# Altium project pi-dock.PrjPcb
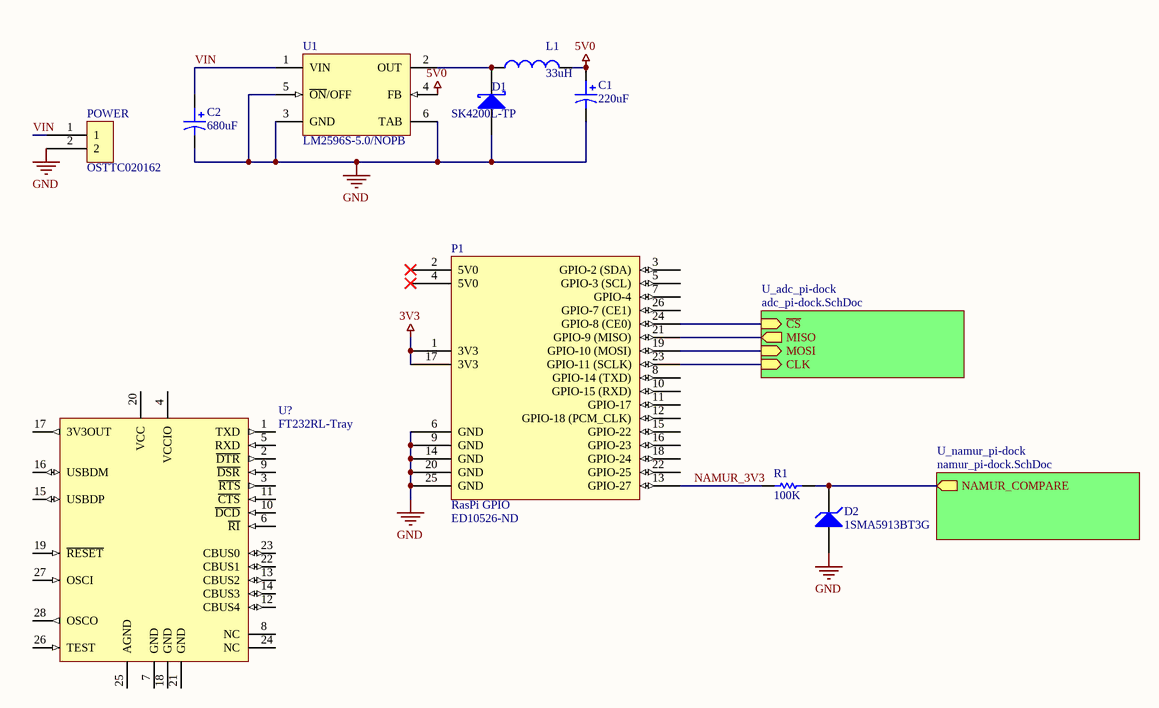
[diagram p0: top_pi-dock.SchDoc]
3 sheets, 46 parts. Net scope: hierarchical (ports join the sheet entries above them; power ports are global).
Board file: pi-dock.PcbDoc
Sheets:
  top_pi-dock.SchDoc
    U_namur_pi-dock = namur_pi-dock.SchDoc
    U_adc_pi-dock = adc_pi-dock.SchDoc

## Sheet top_pi-dock.SchDoc
size Letter

### Parts
C1  220uF  [CAPMP7343X31N]
C2  680uF  [Panasonic FM Series, Type A]
D1  SK4200L-TP  [DIOM6959X26N [DO-214AB]]
D2  1SMA5913BT3G  [DIOM6959X26N [DO-214AB]]
L1  33uH  [CDRH127]
P1  RasPi GPIO  Supplier Part Number 1: ED10526-ND  [HDR2X13]
POWER  OSTTC020162  [DIP2_5MM_SCREWTERM]
R1  100K  [RES_8085]
U1  LM2596S-5.0/NOPB  [TS5B_L]
U?  FT232RL-Tray  [SSOP-28_L]

### Sub-sheets
U_adc_pi-dock = adc_pi-dock.SchDoc: ~{CS} (in), MOSI (in), CLK (in), MISO (out)
U_namur_pi-dock = namur_pi-dock.SchDoc: NAMUR_COMPARE (out)

### Nets
3V3: P1.1(3V3) P1.17(3V3)
5V0: C1.1 L1.2 U1.4(FB)
GND: C1.2 C2.2 D1.2(A) D2.2(A) P1.6(GND) P1.9(GND) P1.14(GND) P1.20(GND) P1.25(GND) POWER.2 U1.3(GND) U1.5(~{ON}/OFF) U1.6(TAB)
NAMUR_3V3: P1.13(GPIO-27) R1.2
VIN: C2.1 POWER.1 U1.1(VIN)
NetD1_1: D1.1(K) L1.1 U1.2(OUT)
NetD2_1: D2.1(K) R1.1 ; sheet U_namur_pi-dock/NAMUR_COMPARE
NetP1_19: P1.19(GPIO-10_(MOSI)) ; sheet U_adc_pi-dock/MOSI
NetP1_21: P1.21(GPIO-9_(MISO)) ; sheet U_adc_pi-dock/MISO
NetP1_23: P1.23(GPIO-11_(SCLK)) ; sheet U_adc_pi-dock/CLK
NetP1_24: P1.24(GPIO-8_(CE0)) ; sheet U_adc_pi-dock/~{CS}

Not connected (* = marked no-connect by the designer): P1 2(5V0)* 3(GPIO-2_(SDA)) 4(5V0)* 5(GPIO-3_(SCL)) 7(GPIO-4) 8(GPIO-14_(TXD)) 10(GPIO-15_(RXD)) 11(GPIO-17) 12(GPIO-18_(PCM_CLK)) 15(GPIO-22) 16(GPIO-23) 18(GPIO-24) 22(GPIO-25) 26(GPIO-7_(CE1)); U? 1(TXD) 2(~{DTR}) 3(~{RTS}) 4(VCCIO) 5(RXD) 6(~{RI}) 7(GND) 8(NC) 9(~{DSR}) 10(~{DCD}) 11(~{CTS}) 12(CBUS4) 13(CBUS2) 14(CBUS3) 15(USBDP) 16(USBDM) 17(3V3OUT) 18(GND) 19(~{RESET}) 20(VCC) 21(GND) 22(CBUS1) 23(CBUS0) 24(NC) 25(AGND) 26(TEST) 27(OSCI) 28(OSCO)

### Library data of the parts
C1 = T491D227K010AT: Kemet CAP TANT 220UF 10V 10% 2917; Value: 220uF; Supplier 1: Digi-Key; Supplier Part Number 1: 399-8379-1-ND; ComponentLink1Description: Datasheet; ComponentLink1URL: http://www.kemet.com/Lists/ProductCatalog/Attachments/254/KEM_T2005_T491.pdf
C2 = EEU-FM1E681: Panasonic CAP ALUM 680UF 25V 20% RADIAL; Value: 680uF; ComponentLink1Description: Datasheet; ComponentLink1URL: http://industrial.panasonic.com/www-data/pdf/ABA0000/ABA0000CE108.pdf; Supplier 1: Digi-Key; Supplier Part Number 1: P12390-ND
D1 = SK4200L-TP: MCC DIODE SCHOTTKY 200V 4A DO214AB; ComponentLink1Description: Datasheet; ComponentLink1URL: http://www.mccsemi.com/up_pdf/SK4200L(SMC).pdf; Supplier 1: Digi-Key; Supplier Part Number 1: SK4200L-TPMSCT-ND
D2 = 1SMA5913BT3G: DIODE ZENER 3.3V 1.5W SMA; ComponentLink1Description: Datasheet; ComponentLink1URL: http://www.onsemi.com/pub_link/Collateral/1SMA5913BT3-D.PDF; Supplier 1: Digi-Key; Supplier Part Number 1: 1SMA5913BT3GOSCT-ND
L1 = CDRH127NP-330MC: Sumida Fixed Inductors 33uH 3A; Value: 33uH; ComponentLink1Description: Datasheet; ComponentLink1URL: http://www.sumida.com/products/pdf/CDRH127,127LD.pdf
P1 = RasPi Header: Raspberry Pi GPIO Header, 13-Pin, Dual row; ComponentLink1Description: Raspberry Pi GPIO Pinout; ComponentLink1URL: http://www.hobbytronics.co.uk/image/data/tutorial/raspberry-pi/gpio-pinout-rev2.jpg; Supplier 1: Digi-Key
POWER = OSTTC020162: ON SHORE TERMINAL BLOCK 5MM VERT 2POS PCB; ComponentLink1URL: http://www.on-shore.com/sites/default/files/manuals/osttcxx0162.pdf; ComponentLink1Description: Datasheet; Supplier 1: Digi-Key; Supplier Part Number 1: ED2600-ND
R1 = CHIP-RES: SMD Chip Resistor; Value: 100K
U1 = CMP-0069-00269-2: SIMPLE SWITCHER® Power Converter 150 KHz 3A Step-Down Voltage Regulator, 5-pin TO-263, Pb-Free; Manufacturer: National Semiconductor; PackageTopMarking: NSUZXYTTE#*LM2596S*-5.0 P+; PowerWise: N; PinCount: 5; ComponentLink3Description: TS5B Package Page; ComponentLink1Description: LM2596 Datasheet; DatasheetVersion: May-2002; ComponentLink3URL: http://www.national.com/packaging/folders/ts5b.html; PackageReference: TS5B; RoHS: Y; ComponentLink2Description: LM2596 Web Page; ComponentLink2URL: http://www.national.com/pf/LM/LM2596.html; ComponentLink1URL: http://www.national.com/ds/LM/LM2596.pdf; CompType: Switcher; RevisionNote: Component URLs added; PackageVersion: revD, Apr-2005; Code_JEDEC: MO-169-AB; PackageDescription: TO-263, Molded, .400 x .390 x .180in, 5 Lead, .067in Pitch, Surface Mount
U? = CMP-0078-00027-1: USB UART Asynchronous Serial Data Transfer Chip, SSOP-28, Tray; DatasheetVersion: ver 2.07, Jul-2010; PackageVersion: 2010; PackageReference: SSOP-28; PackageDescription: 28-Pin Small Outline Package 0.65 mm Pitch

## Sheet namur_pi-dock.SchDoc
size Letter
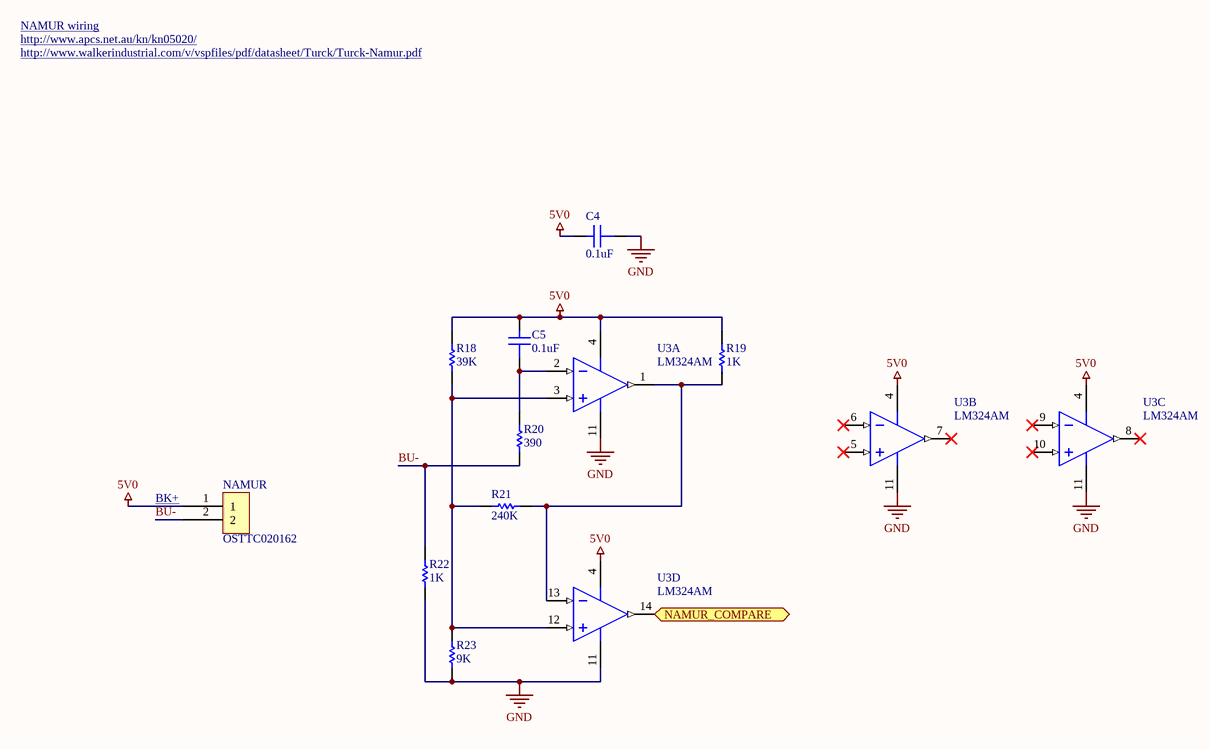
[diagram p1: namur_pi-dock.SchDoc]

### Parts
C4  0.1uF  [CAP_8085]
C5  0.1uF  [CAP_8085]
NAMUR  OSTTC020162  [DIP2_5MM_SCREWTERM]
R18  39K  [RES_8085]
R19  1K  [RES_8085]
R20  390  [RES_8085]
R21  240K  [RES_8085]
R22  1K  [RES_8085]
R23  9K  [RES_8085]
U3  LM324AM  [M14A_N]  (parts A,B,C,D of 4)

### Ports
NAMUR_COMPARE (out)

### Nets
5V0: C4.2 C5.2 NAMUR.1 R18.2 R19.2 U3.4(V+)
GND: C4.1 R22.2 R23.1 U3.11(GND)
BU-: NAMUR.2 R20.2 R22.1
NetC5_1: C5.1 R20.1 U3.2(IN1-)
NetD2_1: U3.14(OUT4) ; port NAMUR_COMPARE
NetR18_1: R18.1 R21.1 R23.2 U3.3(IN1+) U3.12(IN4+)
NetR19_1: R19.1 R21.2 U3.1(OUT1) U3.13(IN4-)

Not connected (* = marked no-connect by the designer): U3 5(IN2+)* 6(IN2-)* 7(OUT2)* 8(OUT3)* 9(IN3-)* 10(IN3+)*

### Notes on the sheet
- NAMUR wiring
- http://www.apcs.net.au/kn/kn05020/
- http://www.walkerindustrial.com/v/vspfiles/pdf/datasheet/Turck/Turck-Namur.pdf
- (near NAMUR) BK+

### Library data of the parts
C4 C5 = CHIP-CAP: SMD Chip Capacitor; Value: 0.1uF
NAMUR = OSTTC020162: as POWER on sheet top_pi-dock; ComponentLink1URL: http://www.on-shore.com/sites/default/files/manuals/osttcxx0162.pdf; ComponentLink1Description: Datasheet; Supplier 1: Digi-Key; Supplier Part Number 1: ED2600-ND
R18-R23 = CHIP-RES: SMD Chip Resistor
  R18: Value: 39K
  R19 R22: Value: 1K
  R20: Value: 390
  R21: Value: 240K
  R23: Value: 9K
U3 = LM324AM: Low Power Quad Operational Amplifier, 14-pin Narrow SOIC; Manufacturer: National Semiconductor; PackageTopMarking: NSUZXYTTE#*LM324AM; PowerWise: N; CompType: Amplifiers; Published: 4-Dec-2008; LatestRevisionDate: 13-Jan-2009; LatestRevisionNote: Sim Model Added.; DatasheetVersion: Aug-2000; PackageVersion: revJ, Jan-1996; PackageReference: M14A; Publisher: Altium Limited; PackageDescription: Molded Package S.O., .150in Wide, 14 Lead; Supplier 1: Farnell; Supplier Part Number 1: 9486909; PartNumber: LM324AM; RoHS: N; PinCount: 14; Code_JEDEC: MS-012AB; Code_IPC: SOIC127P600-14; ComponentLink1Description: LM324 Datasheet; ComponentLink1URL: http://www.national.com/ds/LM/LM324.pdf; ComponentLink2Description: LM324 Web Page; ComponentLink2URL: http://www.national.com/pf/LM/LM324.html; ComponentLink3Description: M14A Package Page; ComponentLink3URL: http://www.national.com/packaging/folders/m14a.html

## Sheet adc_pi-dock.SchDoc
size Letter
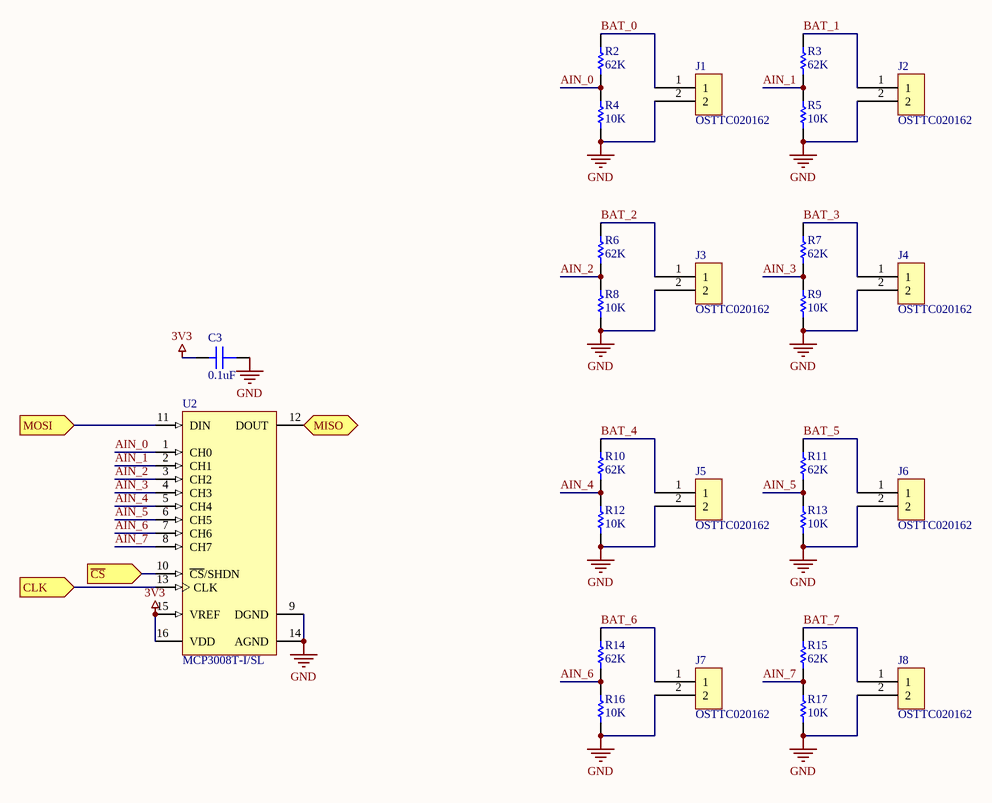
[diagram p2: adc_pi-dock.SchDoc]

### Parts
C3  0.1uF  [CAP_8085]
J1  OSTTC020162  [DIP2_5MM_SCREWTERM]
J2  OSTTC020162  [DIP2_5MM_SCREWTERM]
J3  OSTTC020162  [DIP2_5MM_SCREWTERM]
J4  OSTTC020162  [DIP2_5MM_SCREWTERM]
J5  OSTTC020162  [DIP2_5MM_SCREWTERM]
J6  OSTTC020162  [DIP2_5MM_SCREWTERM]
J7  OSTTC020162  [DIP2_5MM_SCREWTERM]
J8  OSTTC020162  [DIP2_5MM_SCREWTERM]
R2  62K  [RES_8085]
R3  62K  [RES_8085]
R4  10K  [RES_8085]
R5  10K  [RES_8085]
R6  62K  [RES_8085]
R7  62K  [RES_8085]
R8  10K  [RES_8085]
R9  10K  [RES_8085]
R10  62K  [RES_8085]
R11  62K  [RES_8085]
R12  10K  [RES_8085]
R13  10K  [RES_8085]
R14  62K  [RES_8085]
R15  62K  [RES_8085]
R16  10K  [RES_8085]
R17  10K  [RES_8085]
U2  MCP3008T-I/SL  [SOIC-SL16_N]

### Ports
CLK (in), MISO (out), MOSI (in), ~{CS} (in)

### Nets
3V3: C3.2 U2.15(VREF) U2.16(VDD)
GND: C3.1 J1.2 J2.2 J3.2 J4.2 J5.2 J6.2 J7.2 J8.2 R4.1 R5.1 R8.1 R9.1 R12.1 R13.1 R16.1 R17.1 U2.9(DGND) U2.14(AGND)
AIN_0: R2.1 R4.2 U2.1(CH0)
AIN_1: R3.1 R5.2 U2.2(CH1)
AIN_2: R6.1 R8.2 U2.3(CH2)
AIN_3: R7.1 R9.2 U2.4(CH3)
AIN_4: R10.1 R12.2 U2.5(CH4)
AIN_5: R11.1 R13.2 U2.6(CH5)
AIN_6: R14.1 R16.2 U2.7(CH6)
AIN_7: R15.1 R17.2 U2.8(CH7)
BAT_0: J1.1 R2.2
BAT_1: J2.1 R3.2
BAT_2: J3.1 R6.2
BAT_3: J4.1 R7.2
BAT_4: J5.1 R10.2
BAT_5: J6.1 R11.2
BAT_6: J7.1 R14.2
BAT_7: J8.1 R15.2
NetP1_19: U2.11(DIN) ; port MOSI
NetP1_21: U2.12(DOUT) ; port MISO
NetP1_23: U2.13(CLK) ; port CLK
NetP1_24: U2.10(~{CS}/SHDN) ; port ~{CS}

### Library data of the parts
C3 = CHIP-CAP: SMD Chip Capacitor; Value: 0.1uF
J1-J8 = OSTTC020162: as POWER on sheet top_pi-dock; ComponentLink1URL: http://www.on-shore.com/sites/default/files/manuals/osttcxx0162.pdf; ComponentLink1Description: Datasheet; Supplier 1: Digi-Key; Supplier Part Number 1: ED2600-ND
R2-R17 = CHIP-RES: SMD Chip Resistor
  R2 R3 R6 R7 R10 R11 R14 R15: Value: 62K
  R4 R5 R8 R9 R12 R13 R16 R17: Value: 10K
U2 = CMP-0188-00351-2: 2.7V 4-Channel/8-Channel 10-Bit A/D Converters with SPI Serial Interface, 16-Pin SOIC 150mil, Industrial Temperature, Tape and Reel; ComponentLink2Description: Datasheet; Code_JEDEC: MS-012-AC; Code_IPC: SOIC127P600-16; ComponentLink1Description: Manufacturer URL; DatasheetVersion: revD, Dec-2008; PackageReference: SOIC-SL16; ComponentLink2URL: http://ww1.microchip.com/downloads/en/DeviceDoc/21295d.pdf; ComponentLink3Description: Package Specification; ComponentLink3URL: http://www.microchip.com/stellent/groups/techpub_sg/documents/packagingspec/en012702.pdf; PackageVersion: revBB, Aug-2009; RevisionNote: URLs added.; PackageDescription: 16-Lead Plastic Small Outline (SL) - Narrow, 3.90mm Body [SOIC]; ComponentLink1URL: http://www.microchip.com/

## Nets that join several sheets
3V3: top_pi-dock (P1.1 P1.17), adc_pi-dock (C3.2 U2.15 U2.16)
5V0: top_pi-dock (C1.1 L1.2 U1.4), namur_pi-dock (6 pins)
GND: top_pi-dock (13 pins), namur_pi-dock (C4.1 R22.2 R23.1 U3.11), adc_pi-dock (19 pins)
NetD2_1: top_pi-dock (D2.1 R1.1), namur_pi-dock (U3.14)
NetP1_19: top_pi-dock (P1.19), adc_pi-dock (U2.11)
NetP1_21: top_pi-dock (P1.21), adc_pi-dock (U2.12)
NetP1_23: top_pi-dock (P1.23), adc_pi-dock (U2.13)
NetP1_24: top_pi-dock (P1.24), adc_pi-dock (U2.10)